# EAGLE board buf_full_bts_v21 (EAGLE 6.5.0)
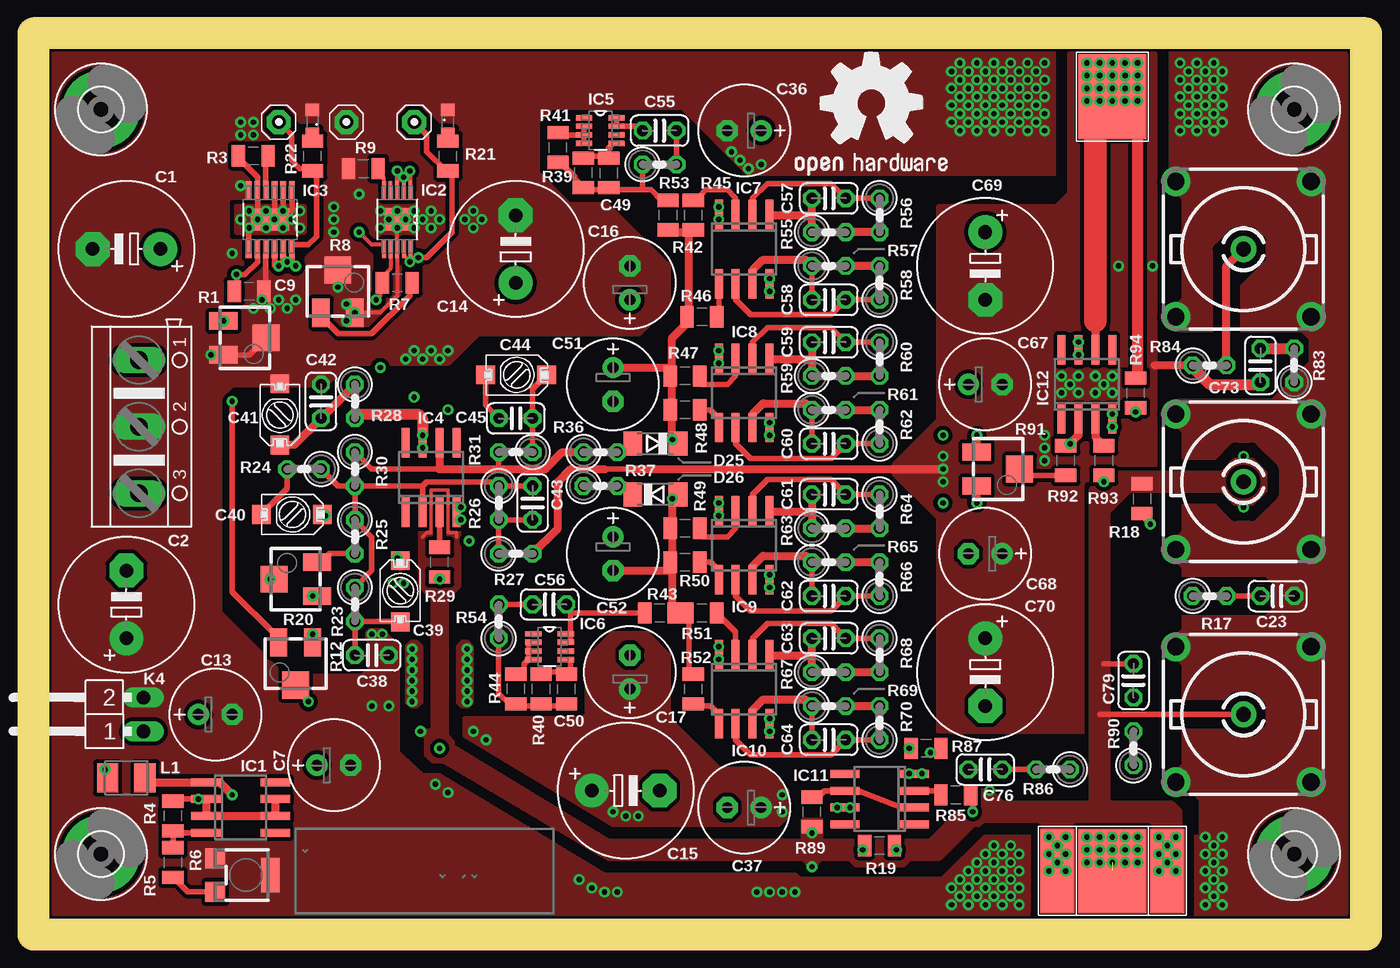
[diagram p1: board, top side]
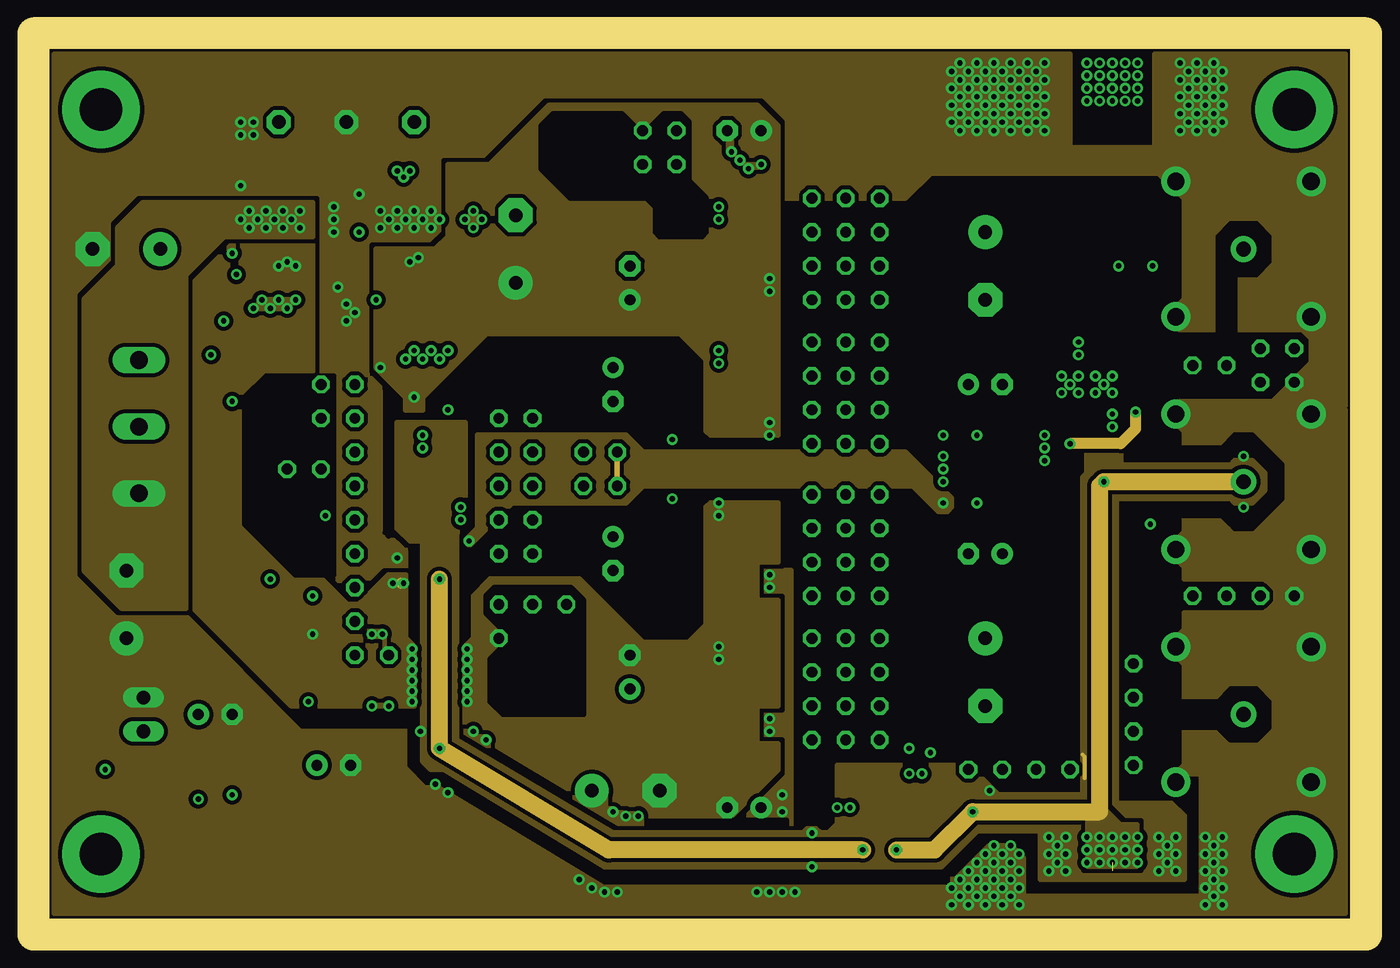
[diagram p2: board, inner layer Route2]
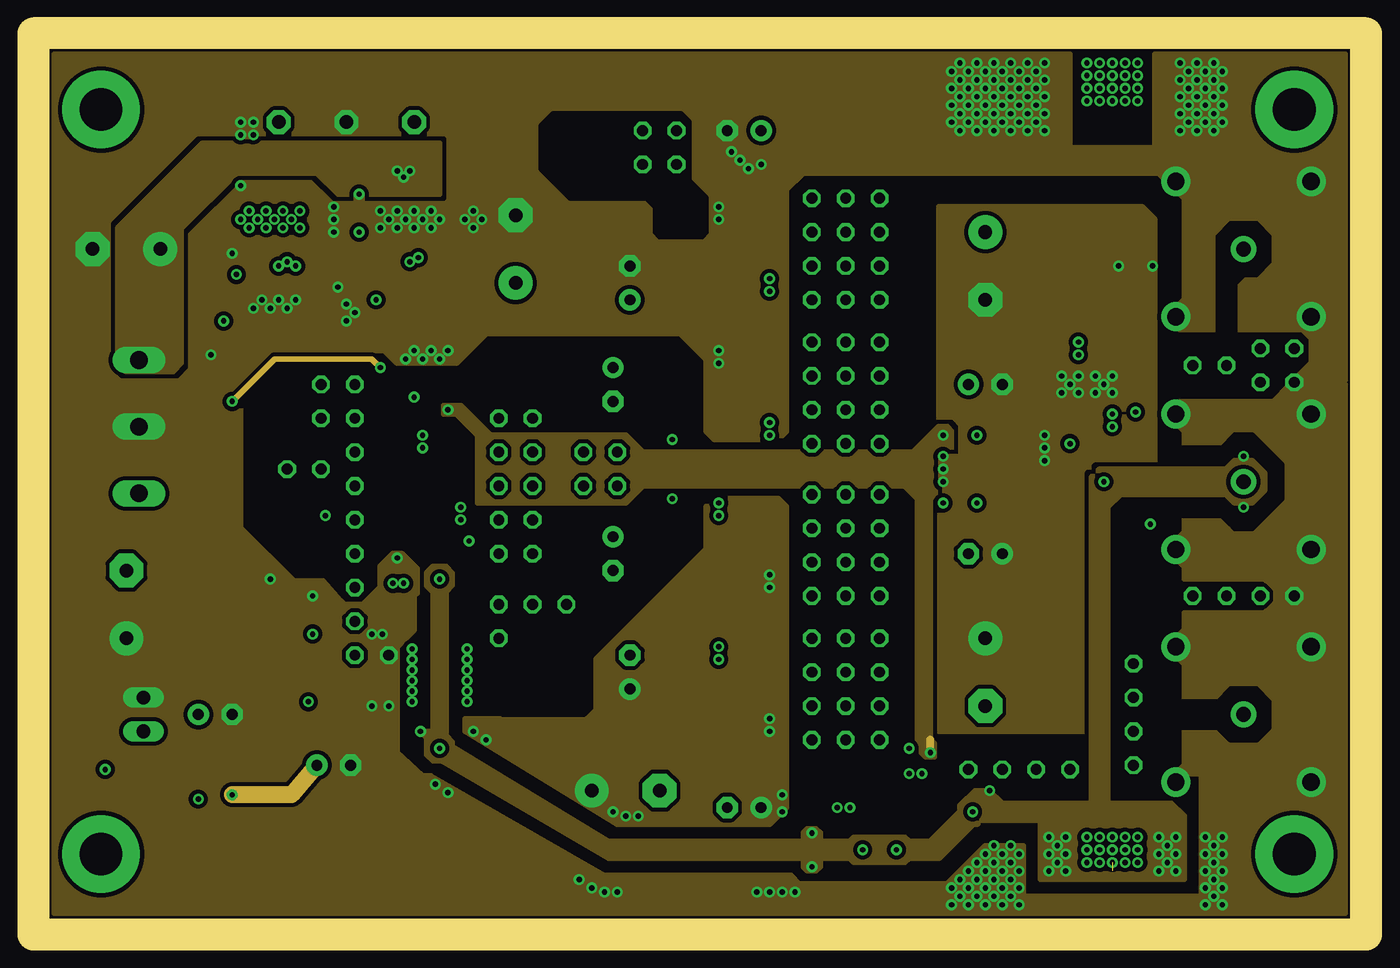
[diagram p3: board, inner layer Route15]
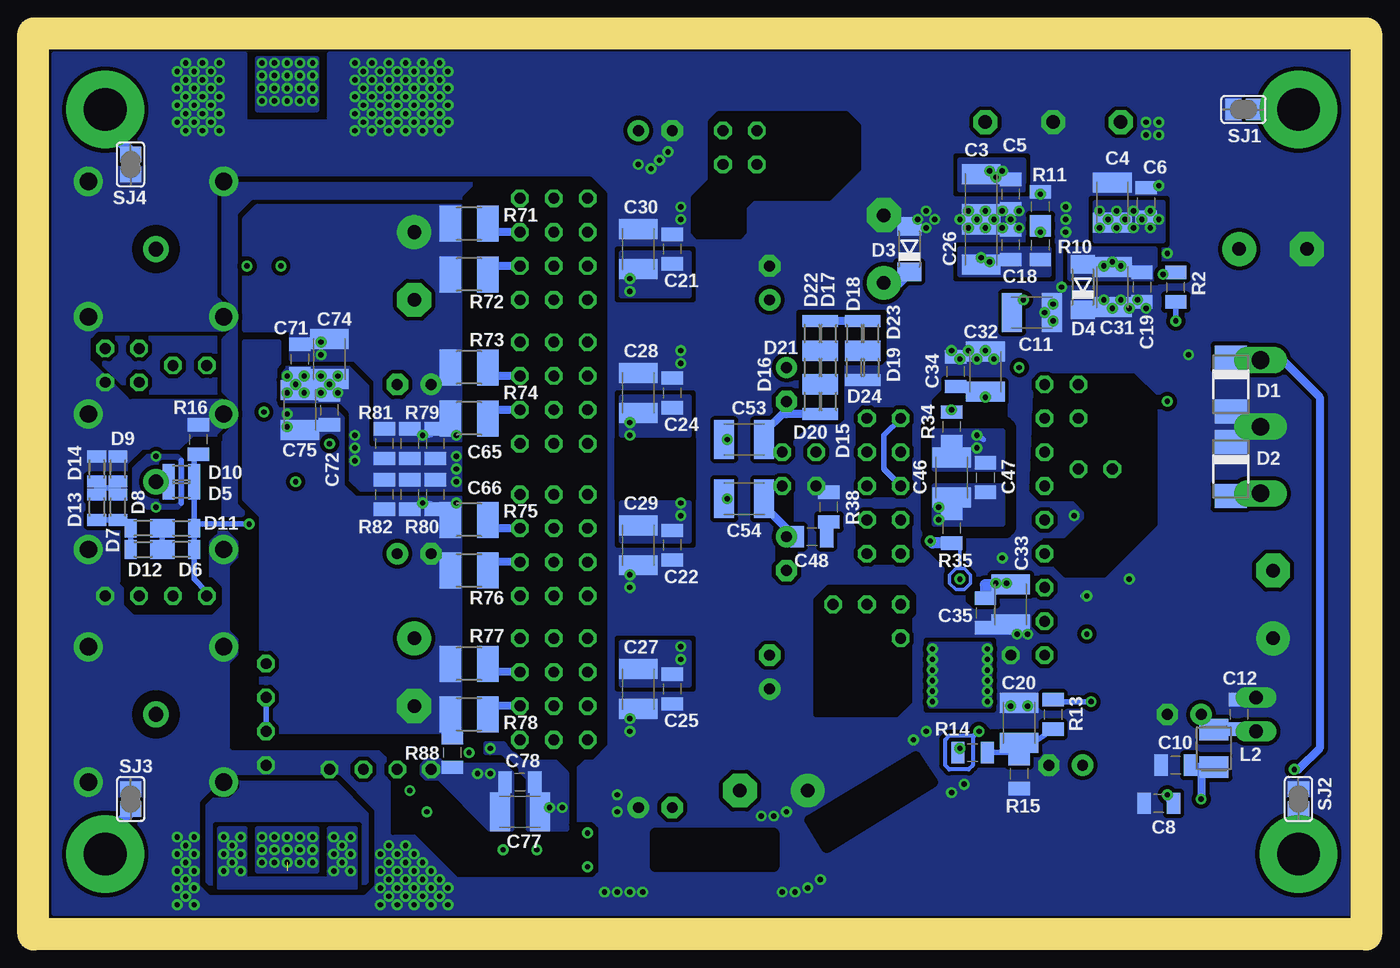
[diagram p4: board, bottom side, seen from below]

Size 100.01 x 67.63 mm. Coordinates in mm from the lower left corner, seen from the top.
Outline: 0,0 100.01,0 100.01,67.63 0,67.63 0,0
Copper layers (1*2+15*16): Top 0.035mm / dielectric 0.5mm / Route2 0.035mm / dielectric 0.35mm / Route15 0.035mm / dielectric 0.5mm / Bottom 0.035mm
Design rules "default *": minimum track width 10mil, minimum drill 24mil, track to track 8mil, track to pad 8mil, pad to pad 8mil, via to via 8mil, smd to smd 8mil, copper to edge 1mil, drill to drill 8mil, minimum pad ring 10mil, minimum via ring 8mil, stop-mask expansion 4mil, vias tented up to drill 0mil, thermal gap 10mil
Net classes: 12 buf1mfb: clearance 0.305 mm
tRestrict: 49 lines
bRestrict: area 89.2,49.8 to 92.4,53; area 89.2,14.9 to 92.4,18.1; 131 lines

## Footprints (pad centres in the part's own frame; a part is rotated, then mirrored left to right if it is on the bottom)
E5-10,5 = drill 1.016 pad 2.54: + -2.54,0 | drill 1.016 pad 2.54 octagon: - 2.54,0
C1210K = smd 1.5 x 2.9: 1 -1.5,0; 2 1.5,0
X0805 = smd 1 x 1.6: P$1 -1.111,0; P$2 1.111,0
E2,5-7 = drill 0.813 pad 1.6: + -1.27,0 | drill 0.813 pad 1.6 octagon: - 1.27,0
C025-024X044 = drill 0.813 octagon: 1 -1.27,0; 2 1.27,0
CTRIMMER9344 = smd 1.4 x 1.4: 1 1.5,-0.041; 2 1.5,4.541
DO-214AC = smd 1.8 x 2.4: A 2.025,0; C -2.025,0
SOD80C = smd 1.4 x 1.8: A 1.7,0; C -1.7,0
MICROMELF-W = smd 0.9 x 1.4: A 0.95,0; C -0.95,0
3,2-PAD = drill 3.2 pad 5.842: B3,2 0,0
SO08 = smd 0.6 x 2.2: 1 -1.905,-2.6; 2 -0.635,-2.6; 3 0.635,-2.6; 4 1.905,-2.6; 5 1.905,2.6; 6 0.635,2.6; 7 -0.635,2.6; 8 -1.905,2.6
SOP50P490X110-11N = smd 1.397 x 0.279: 1 -2.184,0.991; 2 -2.184,0.508; 3 -2.184,0; 4 -2.184,-0.508; 5 -2.184,-0.991; 6 2.184,-0.991; 7 2.184,-0.508; 8 2.184,0; 9 2.184,0.508; 10 2.184,0.991 | smd 1.676 x 1.88: 11 0,0
SOP65P490X110-13N = smd 1.397 x 0.432: 1 -2.184,1.626; 2 -2.184,0.965; 3 -2.184,0.33; 4 -2.184,-0.33; 5 -2.184,-0.965; 6 -2.184,-1.626; 7 2.184,-1.626; 8 2.184,-0.965; 9 2.184,-0.33; 10 2.184,0.33; 11 2.184,0.965; 12 2.184,1.626 | smd 1.651 x 2.845: 13 0,0
SO8 = smd 0.6 x 2.2: 1 -1.905,-2.6; 2 -0.635,-2.6; 3 0.635,-2.6; 4 1.905,-2.6; 5 1.905,2.6; 6 0.635,2.6; 7 -0.635,2.6; 8 -1.905,2.6
SOT65P280X100-8N = smd 1.219 x 0.406: 1 -1.219,0.965; 2 -1.219,0.33; 3 -1.219,-0.33; 4 -1.219,-0.965; 5 1.219,-0.965; 6 1.219,-0.33; 7 1.219,0.33; 8 1.219,0.965
SMD_1X1_S9 = smd 6.35 x 2.54: 1 0,0
SMD_1X1_S8 = smd 6.35 x 5.08: 1 0,0
MA02-1W = drill 1.016 long: 1 -1.27,-2.54; 2 1.27,-2.54
SP_PRO = drill 1.016 pad 1.778 octagon: P$1 0,0
L3225M = smd 1.6 x 2.2: 1 -1.4,0; 2 1.4,0
D0603 = smd 0.94 x 1.016: A -0.901,0; K 0.901,0
RTRIM3214W = smd 1.3 x 2.108: 1 -1.275,-1.609; 3 1.275,-1.609 | smd 2 x 2.032: 2 0,1.609
RT3364W = smd 1.5 x 1.5: 1 -1.25,-2.217; 3 1.25,-2.217 | smd 2.6 x 1.4: 2 0,1.917
0207/2V = drill 0.813 octagon: 1 -1.27,0; 2 1.27,0
R1210 = smd 1.6 x 2.7: 1 -1.4,0; 2 1.4,0
SJ = smd 1.168 x 1.6: 1 -0.762,0; 2 0.762,0
AK500/3 = drill 1.321 long: 1 -5.004,0; 2 0,0; 3 5.004,0
A1944 = drill 1.1 pad 1.93: 1 0,0 | drill 1.3 pad 2.184: 2 5.08,5.08; 3 -5.08,5.08; 4 -5.08,-5.08; 5 5.08,-5.08

## Placement (x,y rotation side)
C1  820u  [E5-10,5]  6.99,51.44 180 top
C2  820u  [E5-10,5]  6.99,24.76 90 top
C3  10u  [C1210K]  28.89,55.56 270 bottom
C4  10u  [C1210K]  19.05,54.93 270 bottom
C5  100n  [X0805]  26.67,55.56 270 bottom
C6  100n  [X0805]  16.51,54.93 270 bottom
C7  220u  [E2,5-7]  22.54,12.7 0 top
C8  100n  [X0805]  15.56,9.84 180 bottom
C9  100n  [X0805]  16.19,48.26 180 top
C10  100n  [X0805]  14.29,12.7 180 bottom
C11  22u  [C1210K]  25.08,46.67 0 bottom
C12  100n  [X0805]  9.53,16.51 90 bottom
C13  220u  [E2,5-7]  13.65,16.51 0 top
C14  820u  [E5-10,5]  36.2,51.44 90 top
C15  820u  [E5-10,5]  44.45,10.79 0 top
C16  220u  [E2,5-7]  44.77,48.89 90 top
C17  220u  [E2,5-7]  44.77,19.68 90 top
C18  100n  [X0805]  26.67,51.75 90 bottom
C19  100n  [X0805]  16.83,48.58 90 bottom
C20  10u  [C1210K]  26.04,15.87 90 bottom
C21  100n  [X0805]  52.07,51.44 90 bottom
C22  100n  [X0805]  52.07,29.21 90 bottom
C23  27p  [C025-024X044]  93.34,25.4 180 top
C24  100n  [X0805]  52.07,40.64 90 bottom
C25  100n  [X0805]  52.07,18.42 90 bottom
C26  10u  [C1210K]  28.89,51.75 90 bottom
C27  10u  [C1210K]  54.61,18.42 90 bottom
C28  10u  [C1210K]  54.61,40.64 90 bottom
C29  10u  [C1210K]  54.61,29.21 90 bottom
C30  10u  [C1210K]  54.61,51.44 90 bottom
C31  10u  [C1210K]  19.05,48.58 90 bottom
C32  10u  [C1210K]  28.57,42.23 90 bottom
C33  10u  [C1210K]  26.67,24.76 90 bottom
C34  100n  [X0805]  30.8,42.23 90 bottom
C35  100n  [X0805]  28.57,24.13 90 bottom
C36  220u  [E2,5-7]  53.34,60.33 180 top
C37  220u  [E2,5-7]  53.34,9.52 180 top
C38  [C025-024X044]  25.4,20.96 0 top
C39  [CTRIMMER9344]  26.04,23.5 0 top
C40  [CTRIMMER9344]  17.14,33.02 270 top
C41  [CTRIMMER9344]  20,41.28 180 top
C42  [C025-024X044]  21.59,40 270 top
C43  0p  [C025-024X044]  37.47,32.39 270 top
C44  [CTRIMMER9344]  33.97,43.5 270 top
C45  82p  [C025-024X044]  36.2,38.73 0 top
C46  10u  [C1210K]  31.11,34.29 270 bottom
C47  100n  [X0805]  28.57,34.29 270 bottom
C48  270p  [X0805]  41.59,29.85 180 bottom
C49  100n  [X0805]  43.18,57.15 270 top
C50  100n  [X0805]  40,18.42 270 top
C51  220u  [E2,5-7]  43.5,41.28 270 top
C52  220u  [E2,5-7]  43.5,28.57 270 top
C53  10u  [C1210K]  46.67,37.15 0 bottom
C54  10u  [C1210K]  46.67,32.7 180 bottom
C55  4n7  [C025-024X044]  46.99,60.33 0 top
C56  4n7  [C025-024X044]  38.73,24.76 180 top
C57  56p  [C025-024X044]  59.69,55.25 0 top
C58  56p  [C025-024X044]  59.69,47.62 0 top
C59  56p  [C025-024X044]  59.69,44.45 0 top
C60  56p  [C025-024X044]  59.69,36.83 0 top
C61  56p  [C025-024X044]  59.69,33.02 0 top
C62  56p  [C025-024X044]  59.69,25.4 0 top
C63  56p  [C025-024X044]  59.69,22.22 0 top
C64  56p  [C025-024X044]  59.69,14.61 0 top
C65  100n  [X0805]  69.85,36.83 270 bottom
C66  100n  [X0805]  69.85,33.02 270 bottom
C67  220u  [E2,5-7]  71.44,41.28 0 top
C68  220u  [E2,5-7]  71.44,28.57 180 top
C69  820u  [E5-10,5]  71.44,50.17 270 top
C70  820u  [E5-10,5]  71.44,19.68 270 top
C71  100n  [X0805]  80.01,43.18 270 bottom
C72  100n  [X0805]  77.79,39.37 270 bottom
C73  [C025-024X044]  92.08,42.7 270 top
C74  10u  [C1210K]  77.79,43.18 270 bottom
C75  10u  [C1210K]  80.01,39.37 270 bottom
C76  [C025-024X044]  71.44,12.38 180 top
C77  10u  [C1210K]  63.5,9.21 180 bottom
C78  100n  [X0805]  63.5,11.43 180 bottom
C79  39p  [C025-024X044]  82.55,19.05 90 top
D1  1N4007  [DO-214AC]  10.16,41.28 270 bottom
D2  1N4007  [DO-214AC]  10.16,34.92 270 bottom
D3  BAT43  [SOD80C]  34.29,51.44 90 bottom
D4  BAT43  [SOD80C]  21.27,48.58 90 bottom
D5  [MICROMELF-W]  88.9,33.34 0 bottom
D6  [MICROMELF-W]  88.9,28.89 180 bottom
D7  [MICROMELF-W]  91.76,30.48 180 bottom
D8  [MICROMELF-W]  93.66,32.07 90 bottom
D9  [MICROMELF-W]  93.66,34.92 90 bottom
D10  [MICROMELF-W]  88.9,34.61 180 bottom
D11  [MICROMELF-W]  88.9,30.48 0 bottom
D12  [MICROMELF-W]  91.76,28.89 0 bottom
D13  [MICROMELF-W]  95.25,32.07 270 bottom
D14  10x1N4148  [MICROMELF-W]  95.25,34.92 270 bottom
D15  10x1N4148  [MICROMELF-W]  40.32,40 90 bottom
D16  [MICROMELF-W]  40.32,42.55 90 bottom
D17  [MICROMELF-W]  40.32,45.09 90 bottom
D18  [MICROMELF-W]  38.42,45.09 270 bottom
D19  [MICROMELF-W]  37.15,42.55 270 bottom
D20  [MICROMELF-W]  41.59,40 270 bottom
D21  [MICROMELF-W]  41.59,42.55 270 bottom
D22  [MICROMELF-W]  41.59,45.09 270 bottom
D23  [MICROMELF-W]  37.15,45.09 90 bottom
D24  [MICROMELF-W]  38.42,42.55 90 bottom
D25  6V2  [SOD80C]  46.67,36.83 180 top
D26  6V2  [SOD80C]  46.67,33.02 0 top
GOLD_ORB_SM1  OSHWLOGO_GOLD_ORB_MED  [OSHW1]  56.52,55.25 0 top
H1  MOUNT-PAD-ROUND3.2  [3,2-PAD]  5.08,61.91 0 top
H2  MOUNT-PAD-ROUND3.2  [3,2-PAD]  5.08,6.03 0 top
H3  MOUNT-PAD-ROUND3.2  [3,2-PAD]  94.61,6.03 0 top
H4  MOUNT-PAD-ROUND3.2  [3,2-PAD]  94.61,61.91 0 top
IC1  LM317LD  [SO08]  15.56,9.52 270 top
IC2  LT3042  [SOP50P490X110-11N]  27.31,53.66 270 top
IC3  LT3090  [SOP65P490X110-13N]  17.78,53.66 270 top
IC4  THS4631  [SO8]  29.85,34.29 0 top
IC5  LT3092TS23  [SOT65P280X100-8N]  42.55,60.33 0 top
IC6  LT3092TS23  [SOT65P280X100-8N]  38.73,21.59 0 top
IC7  AD8066R  [SO8]  53.34,51.44 180 top
IC8  AD8066R  [SO8]  53.34,40.64 180 top
IC9  AD8066R  [SO8]  53.34,29.21 180 top
IC10  AD8066R  [SO8]  53.34,18.42 180 top
IC11  AD8065ARZ  [SO8]  63.5,10.16 90 top
IC12  OPA211  [SO8]  79.06,41.28 0 top
K1  [SMD_1X1_S9]  76.83,4.76 90 top
K2  [SMD_1X1_S8]  80.96,4.76 90 top
K3  [SMD_1X1_S9]  85.09,4.76 90 top
K4  FAN  [MA02-1W]  5.71,16.51 90 top
K5  [SP_PRO]  28.57,60.96 90 top
K6  [SP_PRO]  18.42,60.96 90 top
K7  [SP_PRO]  23.5,60.96 0 top
K8  OUTPUT  [SMD_1X1_S8]  80.96,62.87 90 top
L1  22u  [L3225M]  6.99,11.75 0 top
L2  22u  [L3225M]  11.43,13.97 90 bottom
LD1  LED-0603  [D0603]  31.11,60.96 90 top
LD2  LED-0603  [D0603]  20.96,60.96 270 top
R1  50k  [RTRIM3214W]  15.88,44.77 270 top
R2  220k  [X0805]  14.29,48.58 270 bottom
R3  68k  [X0805]  16.51,58.42 180 top
R4  510  [X0805]  10.48,8.89 90 top
R5  2k  [X0805]  10.48,5.4 90 top
R6  2k2  [RT3364W]  15.88,4.45 270 top
R7  110k  [X0805]  27.31,48.89 180 top
R8  20k  [RTRIM3214W]  22.86,48.26 0 top
R9  680  [X0805]  24.77,57.47 0 top
R10  330k  [X0805]  24.45,51.75 270 bottom
R11  10k  [X0805]  24.45,54.61 270 bottom
R12  20k  [RTRIM3214W]  19.68,20.32 180 top
R13  47k  [X0805]  23.5,16.51 270 bottom
R14  10M  [X0805]  29.53,13.65 180 bottom
R15  10k  [X0805]  26.04,12.06 90 bottom
R16  4k7  [X0805]  87.63,37.15 90 bottom
R17  51  [0207/2V]  88.27,25.4 0 top
R18  33  [X0805]  83.19,32.7 270 top
R19  24  [X0805]  63.5,6.67 180 top
R20  [RTRIM3214W]  19.68,26.67 90 top
R21  2k7  [X0805]  31.11,58.42 270 top
R22  2k7  [X0805]  20.96,58.42 90 top
R23  [0207/2V]  24.13,24.76 270 top
R24  [0207/2V]  20.32,34.92 180 top
R25  [0207/2V]  24.13,29.85 270 top
R26  0R0  [0207/2V]  34.92,32.39 270 top
R27  150  [0207/2V]  36.2,28.57 0 top
R28  [0207/2V]  24.13,40 270 top
R29  24  [X0805]  30.48,27.94 90 top
R30  [0207/2V]  24.13,34.92 270 top
R31  10  [0207/2V]  36.2,36.19 180 top
R34  5R6  [X0805]  31.11,38.1 90 bottom
R35  5R6  [X0805]  31.11,30.48 90 bottom
R36  33  [0207/2V]  42.55,36.19 0 top
R37  [0207/2V]  42.55,33.66 0 top
R38  22  [X0805]  40.32,32.07 270 bottom
R39  3k3  [X0805]  41.28,57.15 90 top
R40  3k3  [X0805]  38.1,18.42 90 top
R41  51  [X0805]  39.37,59.06 90 top
R42  4k7  [X0805]  47.62,53.98 90 top
R43  4k7  [X0805]  46.99,24.13 0 top
R44  51  [X0805]  36.2,18.42 90 top
R45  24  [X0805]  49.53,53.98 90 top
R46  24  [X0805]  50.16,46.36 0 top
R47  24  [X0805]  48.89,41.91 0 top
R48  24  [X0805]  48.89,39.37 0 top
R49  24  [X0805]  48.89,30.48 0 top
R50  24  [X0805]  48.89,27.94 0 top
R51  24  [X0805]  50.16,24.13 0 top
R52  24  [X0805]  49.53,18.42 270 top
R53  680  [0207/2V]  46.99,57.78 0 top
R54  680  [0207/2V]  34.92,23.5 90 top
R55  10  [0207/2V]  59.69,52.7 0 top
R56  100  [0207/2V]  63.5,53.98 270 top
R57  10  [0207/2V]  59.69,50.17 0 top
R58  100  [0207/2V]  63.5,48.89 90 top
R59  10  [0207/2V]  59.69,41.91 0 top
R60  100  [0207/2V]  63.5,43.18 270 top
R61  10  [0207/2V]  59.69,39.37 0 top
R62  100  [0207/2V]  63.5,38.1 90 top
R63  10  [0207/2V]  59.69,30.48 0 top
R64  100  [0207/2V]  63.5,31.75 270 top
R65  10  [0207/2V]  59.69,27.94 0 top
R66  100  [0207/2V]  63.5,26.67 90 top
R67  10  [0207/2V]  59.69,19.68 0 top
R68  100  [0207/2V]  63.5,20.96 270 top
R69  10  [0207/2V]  59.69,17.14 0 top
R70  100  [0207/2V]  63.5,15.87 90 top
R71  220m  [R1210]  67.31,53.34 180 bottom
R72  220m  [R1210]  67.31,49.53 180 bottom
R73  220m  [R1210]  67.31,42.55 180 bottom
R74  220m  [R1210]  67.31,38.73 180 bottom
R75  220m  [R1210]  67.31,31.11 180 bottom
R76  220m  [R1210]  67.31,27.3 180 bottom
R77  220m  [R1210]  67.31,20.32 180 bottom
R78  220m  [R1210]  67.31,16.51 180 bottom
R79  680  [X0805]  71.75,36.83 90 bottom
R80  680  [X0805]  71.75,33.02 90 bottom
R81  680  [X0805]  73.66,36.83 90 bottom
R82  680  [X0805]  73.66,33.02 90 bottom
R83  [0207/2V]  94.61,42.7 90 top
R84  10  [0207/2V]  88.27,42.7 0 top
R85  51  [X0805]  69.22,10.48 180 top
R86  [0207/2V]  76.52,12.38 180 top
R87  10  [X0805]  66.99,13.97 0 top
R88  10  [X0805]  68.58,13.65 270 bottom
R89  51  [X0805]  58.42,9.21 90 top
R90  51  [0207/2V]  82.55,13.97 90 top
R91  20k  [RTRIM3214W]  72.39,34.92 270 top
R92  220k  [X0805]  77.47,35.56 90 top
R93  51  [X0805]  80.33,35.56 90 top
R94  6R8  [X0805]  82.71,40.64 90 top
SJ1  [SJ]  9.21,61.91 0 bottom
SJ2  [SJ]  5.08,10.16 270 bottom
SJ3  [SJ]  92.71,10.16 270 bottom
SJ4  [SJ]  92.71,57.78 90 bottom
X1  [AK500/3]  7.94,38.1 270 top
X2  INPUT-MONITOR  [A1944]  90.8,33.97 0 top
X3  Bootstrap voltage  [A1944]  90.8,51.44 0 top
X4  EP monitor  [A1944]  90.8,16.51 0 top

## Tracks (layer width: path | path; a pad name or v marks a point on that pad's centre or on a via)
+15V  (via drill 0.4)
  Top 0.305: IC2.10 28.3,50.84 v28.89,50.8 | IC2.9 27.81,50.93 v28.26,50.48
  Top 0.406: C55.1 45.39,60.66 IC5.7 IC5.8 | IC8.8 v55.25,38.42 | IC7.8 v55.25,49.21 | v28.89,50.8 29.53,50.8 31.43,52.7 31.43,57.15 31.27,57.31 R21.P$2 30.96,57.31 29.53,58.74 29.53,60.01 K5.P$1 | R12.3 18.09,22.55 14.92,25.72 v14.92,40
  Route15 0.406: v14.92,40 18.1,43.18 25.4,43.18 v26.04,42.55
  Bottom 0.305: v28.26,50.48 v28.89,50.8
  Bottom 0.813: D3.C 35.13,48.89 C14.+ | v28.57,40.32 C32.1 28.57,40.96 29.85,40.96 C34.P$1
  other vias: 55.25,37.47 55.25,48.26
  pour Route2 (rank 2, no thermals): 55.88,37.47 55.88,60.64 54.29,62.23 38.73,62.23 34.29,57.78 31.11,57.78 31.11,52.39 30.16,51.44 25.72,51.44 25.72,42.55 27.94,40.32 27.94,39.37 29.21,39.37 29.21,40.32 33.97,45.09 48.58,45.09 50.48,43.18 50.48,37.78 50.8,37.47
  pour Bottom (rank 2, no thermals): 50.8,37.47 50.8,40.32 55.88,40.32 55.88,37.47
  pour Bottom (rank 2, no thermals): 50.8,47.94 50.8,51.12 55.88,51.12 55.88,47.94
  pour Bottom (no thermals): 23.81,49.53 30.48,49.53 30.48,51.44 23.81,51.44
+15V1
  Top 0.406: IC6.7 39.95,21.91 40.32,21.91 40.32,22.54 | 40.32,22.54 40.32,22.55 | 40.32,22.55 IC6.8 39.95,22.54 40.32,22.54 | 40.32,22.55 40.32,24.13 | 40.32,24.13 40.32,24.45 C56.1 | R43.P$1 40.32,24.13
+15V2  (via drill 0.4)
  Top 0.305: IC2.1 28.3,56.55 v28.26,57.31 | IC2.2 27.81,56.7 v27.78,56.83 | IC2.3 v27.31,57.31
  Top 0.61: v5.4,12.38 5.59,12.2 L1.1
  Bottom 0.305: v28.26,57.31 28.35,57.47 C3.1 | v27.78,56.83 27.94,57.15 | v27.31,57.31 26.99,57.15
  Bottom 0.61: X1.1 7.86,43.18 6.35,43.18 3.49,40.32 3.49,13.97 5.08,12.38 v5.4,12.38
  Bottom 0.813: D1.C 10.16,43.18 8.01,43.18 X1.1
  pour Bottom (no thermals): 25.72,55.88 30.48,55.88 30.48,58.1 25.72,58.1
  pour Route15 (no thermals): 11.11,42.86 11.11,53.02 15.24,57.15 21.27,57.15 22.86,55.56 30.48,55.56 30.48,59.37 12.7,59.37 6.35,53.02 6.35,42.86 6.99,42.23 10.48,42.23
-15V  (via drill 0.4)
  Top 0.406: C50.P$2 39.85,17.14 38.1,17.14 R40.P$1 37.94,17.14 36.2,17.14 R44.P$1 35.72,17.3 34.92,18.1 R54.1 | IC9.4 v51.44,31.43 | IC10.4 v51.44,20.64 | IC3.11 18.75,50.5 v19.05,50.48 | IC3.10 18.11,50.18 v18.42,50.17 | v19.68,50.17 19.41,50.2 IC3.12 19.41,51.75 20.64,51.75 21.27,52.39 21.27,56.83 20.96,57.15 R22.P$1 20.48,57.31 20.32,57.47 20,57.47 19.37,58.1 19.37,60.01 K6.P$1 | R12.1 21.3,21.91 v20.96,22.54
  Route2 0.813: v27.78,26.35 27.62,26.35
  Bottom 0.406: v19.05,50.48 18.73,50.39 C31.2
  Bottom 0.813: 28.57,25.63 28.57,26.26 C33.2 | 28.57,25.63 C33.2 | C35.P$2 28.57,25.63 | C33.2 v27.78,26.35
  other vias: 51.44,21.59 51.44,32.39 28.42,17.46 28.42,18.26 28.42,19.05 28.42,19.84 28.42,20.64 28.42,21.43 32.54,17.46 32.54,18.26 32.54,19.05 32.54,19.84 32.54,20.64 32.54,21.43 26.99,26.35
  pour Bottom (rank 2, no thermals): 50.8,18.73 55.88,18.73 55.88,21.91 50.8,21.91
  pour Bottom (rank 2, no thermals): 50.8,29.53 55.88,29.53 55.88,32.39 50.8,32.39
  pour Route2 (rank 2, no thermals): 50.8,32.39 55.88,32.39 55.88,27.94 54.29,27.94 54.29,25.08 55.88,25.08 55.88,17.14 54.29,17.14 54.29,14.29 55.88,14.29 55.88,12.38 52.39,8.89 43.5,8.89 32.39,15.56 32.39,21.59 33.02,22.22 33.02,25.4 34.29,26.67 40.96,26.67 45.72,21.91 49.21,21.91 50.48,23.18 50.48,32.07
  pour Route2 (rank 2, no thermals): 12.07,52.39 20.96,52.39 20.96,27.3 23.5,24.76 24.45,24.76 26.67,26.99 27.94,26.99 27.94,22.22 28.57,21.59 28.57,17.14 19.37,17.14 12.07,24.45
  pour Bottom (rank 2, no thermals): 28.26,17.14 28.26,21.75 32.7,21.75 32.7,17.14
  pour Bottom (no thermals): 15.88,49.21 22.22,49.21 22.22,51.44 15.88,51.44
  pour Top: 28.1,21.59 28.42,21.91 28.73,21.91 29.05,21.59 29.05,17.46 28.73,17.14 28.42,17.14 28.1,17.46
  pour Top: 31.91,21.59 32.23,21.91 32.54,21.91 32.86,21.59 32.86,17.46 32.54,17.14 32.23,17.14 31.91,17.46
-15V1  (via drill 0.4)
  Top 0.406: IC3.1 19.41,54.29 19.37,54.29 | IC3.2 v18.75,54.29 v18.73,54.29 | IC3.3 18.11,54.29 18.1,54.29 | C6.P$2 16.82,53.82 IC3.5 16.82,56.84 15.4,58.26 R3.P$2 | IC3.7 16.15,53.02 v16.19,53.02
  Bottom 0.813: X1.3 9.96,33.1 D2.A
  other vias: 16.19,54.29 16.83,53.66 17.46,54.29 17.46,53.02 18.1,53.66 18.73,53.02 19.37,53.66 20,54.29 20,53.02 15.56,53.66
  pour Bottom (no thermals): 15.24,52.07 20.32,52.07 20.32,54.93 15.24,54.93
  pour Top (no thermals): 15.24,52.7 20.32,52.7 20.32,54.61 15.24,54.61
  pour Route2 (no thermals): 3.81,27.3 6.67,24.45 11.43,24.45 11.43,49.53 14.29,52.39 20.96,52.39 20.96,54.93 8.26,54.93 6.35,53.02 6.35,50.17 3.81,47.62
BTS+  (via drill 0.4)
  Top 0.406: 70.78,36.17 R91.1
  Top 0.61: 70.78,36.17 v70.8,37.47 | R87.P$2 67.94,13.65 v67.31,13.65 | IC12.7 v78.42,44.45
  Route15 0.61: v67.31,13.65 67.31,14.61
  Bottom 0.406: R34.P$2 v31.11,39.37 | 68.9,53.34 R71.2
  Bottom 0.61: v70.8,37.47 70.17,37.62 C65.P$1
  other vias: 68.26,37.47 78.42,43.5
  pour Bottom (rank 2, no thermals): 67.94,54.61 67.94,37.15 74.3,37.15 74.3,41.59 75.88,43.18 80.64,43.18 80.64,45.4 84.14,45.4 84.14,53.66 83.19,54.61
  pour Route15 (no thermals): 65.41,33.66 66.36,32.7 66.36,13.97 66.99,13.33 67.63,13.33 67.63,14.29 67.31,14.61 67.31,32.7 68.9,34.29 68.9,37.78 68.58,38.1 67.94,38.1 66.04,36.19 45.72,36.19 44.45,37.47 34.29,37.47 32.07,39.69 30.8,39.69 30.8,39.05 31.75,39.05 33.34,37.47 33.34,32.39 44.45,32.39 45.72,33.66
BTS-  (via drill 0.4)
  Top 0.406: 70.78,33.36 R91.3
  Top 0.61: 70.78,33.36 v70.8,32.39 | IC12.4 v80.96,38.1
  Bottom 0.254: 30.48,27.46 30.8,27.46 31.27,26.99 31.27,26.35 30.8,25.88 30.16,25.88 29.69,26.35 29.69,26.99 30.16,27.46 30.48,27.46 | 30.48,27.46 30.48,28.89 30.96,29.37 R35.P$1 | R35.P$1
  Bottom 0.61: v70.8,32.39 70.17,32.23 C66.P$2
  Bottom 0.813: R35.P$1 32.54,29.37 v32.7,29.53
  other vias: 68.26,32.39 80.96,39.05
  pour Bottom (no thermals): 67.94,32.7 75.88,32.7 76.83,33.66 76.83,38.73 77.47,39.37 81.6,39.37 81.91,39.69 81.91,42.55 81.6,42.86 81.6,44.45 84.14,44.45 84.14,32.7 82.87,31.43 82.87,15.24 67.94,15.24
  pour Route2 (no thermals): 68.9,32.7 65.41,36.19 45.72,36.19 44.45,37.47 33.34,37.47 33.34,30.48 32.39,29.53 32.7,29.21 35.88,32.39 44.45,32.39 45.72,33.66 66.04,33.66 67.94,31.75 68.58,31.75 68.9,32.07
BTSG  (via drill 0.4)
  Top 0.406: 40.32,34.92 42.23,34.92 | 42.86,34.92 44.77,34.92
  Top 0.61: R27.2 39.37,30.48 39.37,33.97 40.32,34.92 | 42.23,34.92 42.86,34.92 | 44.77,34.92 v68.26,34.92 | R84.1 84.14,42.7
  Top 0.813: R84.1 87,42.55 88.27,41.28 91.92,41.28 C73.2
  other vias: 77.15,41.91 77.15,40.64 77.79,41.28 78.42,41.91 78.42,40.64 79.69,41.91 79.69,40.64 80.33,41.28 80.96,41.91 80.96,40.64 68.26,35.88 68.26,33.97 75.88,35.56 75.88,36.51 75.88,37.47 81.44,50.17 83.98,50.17
  pour Route15 (rank 2, no thermals): 67.94,15.24 82.87,15.24 82.87,31.75 84.14,33.02 84.14,53.66 83.19,54.61 67.94,54.61
  pour Top (rank 4, no thermals): 67.94,31.27 67.94,15.24 82.87,15.24 82.87,31.43 84.14,32.7 84.14,66.04 77.79,66.04 77.79,55.56 76.83,54.61 67.94,54.61 67.94,38.58 64.61,35.24 64.61,34.61
  pour Bottom (rank 4, no thermals): 67.94,33.34 75.56,33.34 76.2,33.97 76.2,39.37 76.83,40 80.96,40 81.28,40.32 81.28,42.23 80.96,42.55 76.2,42.55 74.93,41.28 74.93,36.83 74.61,36.51 67.94,36.51
EP  (via drill 0.4)
  Top 0.254: 31.75,29.85 31.75,30.16 31.11,30.16 31.11,33.34 29.85,33.34 29.85,30.16 29.53,30.16 29.21,29.85
  Top 0.406: X4.1 80.01,16.51 | C79.2 80.33,20.32
  Route2 0.305: 78.9,11.75 78.9,13.33 78.74,13.49
  Bottom 0.305: 29.53,14.92 31.27,14.92 31.59,14.61 31.59,12.7 31.27,12.38 29.85,12.38 29.53,12.7 29.53,14.92 | v29.05,15.24 29.37,14.92 29.53,14.92
  Bottom 0.406: 88.9,32.39 88.9,35.56
  other vias: 58.42,7.62 58.42,5.08 77.47,7.3 76.2,7.3 76.83,6.67 77.47,6.03 76.2,6.03 76.83,5.4 77.47,4.76 76.2,4.76 84.45,7.3 85.72,7.3 85.09,6.67 84.45,6.03 85.72,6.03 85.09,5.4 85.72,4.76 84.45,4.76 90.8,35.88 90.8,32.07 71.75,10.79
  pour Top (no thermals): 29.53,13.49 30,13.02 30.8,13.02 43.18,5.71 57.78,5.71 58.42,5.08 59.05,5.71 61.28,5.71 61.75,5.24 65.25,5.24 65.72,5.71 67.94,5.71 70.48,8.25 70.96,8.25 71.28,8.57 75.56,8.57 75.88,8.25 75.88,4.45 77.79,4.45 77.79,8.25 78.11,8.57 83.82,8.57 84.14,8.25 84.14,4.45 86.04,4.45 86.04,9.21 85.41,9.84 80.64,9.84 80.64,31.75 82.23,33.34 89.22,33.34 90.17,32.39 91.44,32.39 92.39,33.34 92.39,34.61 91.44,35.56 90.17,35.56 89.22,34.61 79.69,34.61 79.69,33.66 79.38,33.34 79.38,9.84 72.71,9.84 71.75,10.79 71.12,10.79 67.31,6.98 59.05,6.98 59.05,8.57 57.78,8.57 57.78,6.98 43.18,6.98 31.43,14.13 31.43,14.45 30.96,14.92 30.96,25.24 31.91,26.19 31.91,30.16 32.07,30.32 32.07,33.02 28.89,33.02 28.89,30.32 29.05,30.16 29.05,26.19 30,25.24 30,15.24 29.05,15.24 29.53,14.76
  pour Route15 (no thermals): 79.38,34.29 80.01,34.92 89.53,34.92 90.17,35.56 91.44,35.56 92.39,34.61 92.39,33.34 91.44,32.39 90.17,32.39 89.53,33.02 81.6,33.02 80.64,32.07 80.64,9.84 85.41,9.84 86.36,8.89 86.36,4.13 75.56,4.13 75.56,8.57 71.12,8.57 70.8,8.25 70.48,8.25 67.94,5.71 65.72,5.71 65.41,5.4 61.59,5.4 61.28,5.71 59.05,5.71 59.05,5.08 58.74,4.76 58.1,4.76 57.78,5.08 57.78,5.71 43.18,5.71 30.64,13.02 30,13.02 29.53,13.49 29.53,14.76 29.05,15.24 30,15.24 30,25.72 29.53,26.19 29.53,27.15 30,27.62 30.96,27.62 31.43,27.15 31.43,26.19 30.96,25.72 30.96,14.92 31.43,14.45 31.43,14.13 43.18,6.98 57.78,6.98 57.78,7.62 58.1,7.94 58.74,7.94 59.05,7.62 59.05,6.98 61.28,6.98 61.59,7.3 65.41,7.3 65.72,6.98 67.31,6.98 69.53,9.21 69.53,9.68 70.64,10.79 71.75,10.79 72.71,9.84 79.38,9.84
  pour Route2 (rank 2, no thermals): 59.69,7.62 59.05,7.62 58.74,7.94 58.1,7.94 57.78,7.62 43.5,7.62 31.75,14.61 31.75,29.85 32.39,30.48 32.39,38.42 27.31,38.42 27.31,30.48 28.26,29.53 29.21,29.53 29.21,13.02 29.85,12.38 30.8,12.38 42.86,5.08 68.1,5.08 70.8,7.78 75.56,7.78 75.56,4.13 86.36,4.13 86.36,8.89 85.41,9.84 81.28,9.84 81.28,32.7 89.85,32.7 90.17,32.39 91.44,32.39 92.39,33.34 92.39,34.61 91.44,35.56 90.17,35.56 89.85,35.24 81.6,35.24 81.6,39.69 79.06,39.69 79.06,34.61 78.74,34.29 78.74,10.48 72.39,10.48 70.17,12.7 60.33,12.7 60.33,8.25
  pour Bottom (no thermals): 88.58,35.24 89.22,35.88 91.44,35.88 92.39,34.92 92.39,33.02 91.44,32.07 89.22,32.07 88.58,32.7
  pour Bottom (no thermals): 75.88,3.49 80.96,3.49 80.96,4.13 77.79,4.13 77.79,7.94 75.88,7.94
  pour Bottom (no thermals): 80.96,3.49 86.04,3.49 86.04,7.94 84.14,7.94 84.14,4.13 80.96,4.13
GND  (via drill 0.4)
  Top 0.305: R8.3 24.16,46.67 26.04,46.67 27.31,47.94 IC2.8 v27.31,53.02
  Top 0.406: IC3.9 17.45,48.26 C9.P$1 | IC3.6 16.15,56.2 v15.56,56.2 | IC10.8 v55.25,16.19 | IC7.4 v51.44,53.66 | IC8.4 v51.44,42.86 | v55.25,26.99 IC9.8 | R20.1 v20.96,25.4 | R20.2 v17.78,26.67 | C40.2 21.77,31.43 v21.91,31.43 | C39.2 27.54,28.17 v27.31,28.26 | v13.34,43.5 R1.3 16.21,43.49 R1.2 | R8.2 v22.86,48.58
  Bottom 0.406: v20.96,25.4 21.27,25.4
  other vias: 26.04,54.29 26.04,53.02 26.67,53.66 27.31,54.29 27.94,53.66 28.57,54.29 28.57,53.02 29.21,53.66 29.85,54.29 29.85,53.02 55.25,15.24 55.25,26.04 51.44,43.81 51.44,54.61 19.68,47.62 19.05,46.99 18.42,47.62 17.14,47.62 17.78,46.99 16.51,46.99 23.5,47.31 23.5,46.04 24.13,46.67 30.48,53.66 27.94,43.18 29.21,43.18 28.57,43.81 30.48,43.18 29.85,43.81 31.11,43.81 24.45,55.56 14.92,51.12 25.4,22.54 22.54,52.7 22.54,53.66 22.54,54.61 16.51,60.01 15.56,60.01 16.51,60.96 15.56,60.96 32.39,53.66 33.02,54.29 33.02,53.02 33.66,53.66 43.5,9.21 42.86,3.18 41.91,3.49 40.96,4.13 43.81,3.18 45.4,8.89 44.45,8.89 54.29,3.18 55.25,3.18 56.2,3.18 57.15,3.18 56.2,9.21 56.2,10.48 53.66,57.47 54.61,57.78 53.02,58.1 52.39,58.74 26.67,17.14 25.4,17.14 26.19,22.54 75.88,65.41 75.88,64.14 75.25,64.77 75.25,63.5 75.88,62.87 74.61,64.14 74.61,65.41 73.98,64.77 73.34,65.41 72.71,64.77 73.34,64.14 73.98,63.5 74.61,62.87 73.34,62.87 72.71,63.5 72.07,64.14 72.07,65.41 72.07,62.87 71.44,63.5 71.44,64.77 70.8,65.41 70.8,64.14 70.8,62.87 70.17,64.77 70.17,63.5 69.53,65.41 69.53,64.14 69.53,62.87 68.9,63.5 68.9,64.77 86.04,62.87 86.04,64.14 86.68,63.5 86.68,64.77 86.04,65.41 87.31,64.14 87.31,62.87 87.95,63.5 87.95,64.77 87.31,65.41 88.58,65.41 88.58,64.14 88.58,62.87 89.22,63.5 89.22,64.77 86.68,62.23 87.95,62.23 86.04,61.59 87.31,61.59 88.58,61.59 89.22,62.23 89.22,60.96 87.95,60.96 86.68,60.96 86.04,60.33 87.31,60.33 88.58,60.33 73.98,2.22 73.34,2.86 73.98,3.49 73.34,4.13 73.98,4.76 73.34,5.4 73.98,6.03 73.34,6.67 72.71,6.03 72.71,4.76 72.71,3.49 72.71,2.22 72.07,2.86 72.07,4.13 72.07,5.4 72.07,6.67 71.44,6.03 71.44,4.76 71.44,3.49 71.44,2.22 70.8,2.86 70.8,4.13 70.8,5.4 70.17,4.76 70.17,3.49 70.17,2.22 69.53,2.86 69.53,4.13 68.9,3.49 68.9,2.22 87.95,2.22 88.58,2.86 89.22,2.22 87.95,3.49 89.22,3.49 88.58,4.13 87.95,4.76 89.22,4.76 88.58,5.4 87.95,6.03 89.22,6.03 88.58,6.67 87.95,7.3 89.22,7.3 33.02,15.24 33.97,14.61 31.11,10.64 30.16,11.27 75.25,62.23 75.25,60.96 74.61,61.59 73.98,62.23 72.71,62.23 73.34,61.59 73.98,60.96 74.61,60.33 73.34,60.33 72.71,60.96 72.07,61.59 72.07,60.33 71.44,60.96 71.44,62.23 70.8,61.59 70.8,60.33 70.17,62.23 70.17,60.96 69.53,61.59 69.53,60.33 68.9,60.96 68.9,62.23 75.88,61.59 75.88,60.33
  pour Bottom (rank 5, no thermals): 1.27,1.59 98.42,1.59 98.42,66.04 84.14,66.04 84.14,60.96 77.79,60.96 77.79,66.04 1.27,66.04
  pour Top (rank 5, no thermals): 1.59,35.88 13.97,35.88 13.97,40.32 14.92,41.28 21.91,41.28 23.5,42.86 31.11,42.86 33.34,45.09 45.4,45.09 47.62,47.31 47.62,50.17 43.02,54.77 40.16,54.77 37.78,57.15 37.78,60.96 38.89,62.07 48.74,62.07 53.66,57.15 85.72,57.15 85.72,55.88 86.36,55.25 86.36,47.62 85.72,46.99 85.72,45.72 86.04,45.4 95.25,45.4 95.88,44.77 95.88,42.86 93.03,40 86.04,40 85.72,39.69 85.72,38.42 86.36,37.78 86.36,30.16 85.72,29.53 85.72,28.26 86.36,27.62 86.36,22.86 85.72,22.22 85.72,20.96 86.36,20.32 86.36,12.7 85.72,12.06 87.63,10.16 87.63,7.3 71.44,7.3 68.26,4.13 57.47,4.13 57.15,4.45 42.86,4.45 30.48,11.91 29.21,11.91 27.31,13.65 27.31,21.59 26.04,22.86 25.4,22.86 25.08,22.54 25.08,22.22 25.4,21.91 25.4,20 24.77,19.37 18.73,19.37 13.97,24.13 13.97,35.56 1.59,35.56 1.59,1.59 98.42,1.59 98.42,66.04 1.59,66.04
  pour Top (no thermals): 55.88,8.25 56.52,8.89 56.52,10.79 54.93,12.38 51.44,12.38 47.62,16.19 47.62,20.96 46.04,22.54 43.5,22.54 41.59,20.64 41.59,16.51 41.28,16.19 32.39,16.19 32.39,14.92 43.5,8.25
  pour Route2 (rank 5, no thermals): 25.4,42.55 17.46,42.55 15.56,40.64 15.56,21.59 20,17.14 35.88,17.14 40.64,12.38 55.88,12.38
  pour Route15 (rank 5, no thermals): 94.61,41.59 98.42,41.59 98.42,66.04 84.14,66.04 84.14,59.06 77.79,59.06 77.79,66.04 1.59,66.04 1.59,1.59 98.42,1.59 98.42,41.28 94.3,41.28 93.03,40 86.04,40 85.72,39.69 85.72,38.42 86.36,37.78 86.36,30.16 85.72,29.53 85.72,28.26 86.36,27.62 86.36,26.67 92.39,26.67 93.03,26.04 93.03,24.76 92.39,24.13 86.36,24.13 86.36,22.86 85.72,22.22 85.72,20.96 86.36,20.32 86.36,12.7 85.72,12.06 87.63,12.06 87.63,2.86 74.3,2.86 74.3,6.67 71.44,6.67 68.58,3.81 57.47,3.81 56.83,4.45 42.86,4.45 29.85,11.91 29.21,11.91 27.31,13.65 27.31,21.59 28.57,22.86 28.57,25.4 28.89,25.72 28.89,27.3 27.62,28.57 26.99,28.57 26.04,27.62 26.04,26.04 24.77,24.76 23.34,24.76 23.02,25.08 21.75,26.51 19.53,26.51 15.56,30.48 15.56,41.59 17.78,43.81 26.35,43.81 27.31,42.86 31.75,42.86 33.97,45.09 48.58,45.09 50.48,43.18 50.48,37.78 51.12,37.15 55.88,37.15 56.52,37.78 56.52,55.88 57.78,57.15 84.45,57.15 86.36,55.25 86.36,47.62 85.72,46.99 85.72,45.72 86.04,45.4 95.25,45.4 95.88,44.77 95.88,42.86
  pour Route15 (no thermals): 56.52,9.52 56.52,32.07 55.88,32.7 51.12,32.7 50.48,32.07 50.48,28.89 42.23,20.64 42.23,16.83 41.59,16.19 32.39,16.19 32.39,15.24 43.81,8.25 55.25,8.25
  pour Route2 (rank 5, no thermals): 98.42,39.69 85.72,39.69 86.04,40 93.03,40 95.88,42.86 95.88,44.77 95.25,45.4 86.04,45.4 85.72,45.72 85.72,46.99 86.36,47.62 86.36,55.25 84.45,57.15 67.31,57.15 65.41,55.25 40,55.25 25.4,40.64 17.46,40.64 15.56,38.73 15.56,19.68 20,15.24 35.88,15.24 40.64,10.48 54.93,10.48 55.88,11.43 55.88,14.92 54.93,14.92 54.93,16.51 55.88,16.51 55.88,23.81 54.93,23.81 54.93,27.3 56.83,27.3 56.83,6.35 59.05,4.13 69.22,4.13 71.75,6.67 73.34,6.67 74.3,5.71 74.3,2.86 87.63,2.86 87.63,12.06 85.72,12.06 86.36,12.7 86.36,20.32 85.72,20.96 85.72,22.22 86.36,22.86 86.36,24.13 92.39,24.13 93.03,24.76 93.03,26.04 92.39,26.67 86.36,26.67 86.36,27.62 85.72,28.26 85.72,29.53 86.36,30.16 86.36,37.78 85.72,38.42 85.72,39.37 98.42,39.37 98.42,1.59 1.59,1.59 1.59,66.04 77.79,66.04 77.79,59.06 84.14,59.06 84.14,66.04 98.42,66.04
IN  (via drill 0.4)  (1 unrouted)
  Top 0.305: R19.P$1 v64.77,6.35
  Top 0.406: R85.P$1 70.48,10.48 v70.48,9.21
  Top 0.813: R93.P$1 v80.33,33.97
  Route2 1.27: v64.77,6.35 67.63,6.35 v70.48,9.21 80.01,9.21 80.01,33.66 v80.33,33.97 X2.1
  Bottom 0.406: D5.C 89.85,33.97 | 89.85,33.97 D10.A | X2.1 89.85,33.97
  other vias: 80.01,7.3 80.96,7.3 81.91,7.3 80.01,6.35 80.96,6.35 81.91,6.35 80.01,5.4 80.96,5.4 81.91,5.4 79.06,7.3 79.06,6.35 79.06,5.4 82.87,5.4 82.87,6.35 82.87,7.3
  pour Route2 (no thermals): 79.06,5.08 82.87,5.08 82.87,8.25 81.6,8.25 80.33,9.52 79.06,9.52
  pour Bottom (no thermals): 78.74,4.76 83.19,4.76 83.19,7.94 78.74,7.94
N$1
  Top 0.406: IC8.2 53.97,44.45 55.09,45.56 59.85,45.56 C59.2 R60.1
N$2
  Top 0.61: IC8.1 55.25,43.18 58.42,43.18 | C59.1 58.42,43.18 | 58.42,43.18 R59.1
N$3
  Top 0.406: R61.1 C60.1
  Top 0.61: IC8.7 53.97,39.05 54.77,39.85 57.94,39.85 R61.1
N$4
  Top 0.406: R62.1 C60.2 59.85,35.72 53.82,35.72 52.7,36.83 IC8.6
N$5
  cutout Bottom (no thermals): 58.1,13.33 58.74,13.33 59.69,12.38 60.64,13.33 63.18,13.33 64.77,14.92 67.63,14.92 67.63,55.25 66.2,56.67 58.26,56.67 57.15,55.56 57.15,14.29
N$6
  Top 0.61: R61.2 R62.2
  Bottom 0.61: R62.2 66.04,39.37 66.04,38.86 R74.1
N$7
  Top 0.61: R59.2 R60.2
  Bottom 0.61: R60.2 65.27,41.91 R73.1
N$8
  Top 0.406: IC7.2 53.97,55.25 55.09,56.36 59.85,56.36 C57.2 R56.1
N$9
  Top 0.61: R55.1 58.42,53.98 | 58.42,53.98 C57.1 | IC7.1 55.25,53.98 58.42,53.98
N$10
  Top 0.406: R57.1 C58.1
  Top 0.61: IC7.7 53.97,49.85 54.77,50.64 57.94,50.64 R57.1
N$11
  Top 0.406: IC7.6 52.7,47.62 53.82,46.51 59.85,46.51 C58.2 R58.1
N$12
  Top 0.61: R58.2 R57.2
  Bottom 0.61: R58.2 65.72,50.17 65.72,49.72 R72.1
N$13
  Top 0.61: R56.2 R55.2
  Bottom 0.61: R56.2 65.27,52.7 R71.1
N$14
  Top 0.406: IC7.3 52.7,55.25 52.07,55.88 50.48,55.88 49.69,55.09 R45.P$2
N$15
  Top 0.406: IC7.5 51.44,46.51 R46.P$2
N$16
  Top 0.406: R47.P$2 50.01,41.43 50.16,41.28 52.07,41.28 52.7,41.91 IC8.3
N$17
  Top 0.406: R48.P$2 50.8,39.37 51.44,38.73 IC8.5
N$18
  Top 0.406: R68.1 C63.2 59.85,23.34 55.09,23.34 53.97,22.22 IC10.2
N$19
  Top 0.61: IC10.1 55.25,20.96 58.42,20.96 | 58.42,20.96 C63.1 | R67.1 58.42,20.96
N$20
  Top 0.406: R69.1 C64.1
  Top 0.61: IC10.7 53.97,16.83 54.77,17.62 57.94,17.62 R69.1
N$21
  Top 0.406: IC10.6 52.7,14.61 53.82,13.49 59.85,13.49 C64.2 R70.1
N$22
  Top 0.61: R69.2 R70.2
  Bottom 0.61: R70.2 65.27,17.14 R78.1
N$23
  Top 0.61: R67.2 R68.2
  Bottom 0.61: R68.2 65.27,19.68 R77.1
N$24
  Top 0.406: IC9.2 53.97,33.02 55.09,34.13 59.85,34.13 C61.2 R64.1
N$25
  Top 0.61: C61.1 58.42,31.75 | 58.42,31.75 R63.1 | IC9.1 55.25,31.75 58.42,31.75
N$26
  Top 0.406: C62.1 R65.1
  Top 0.61: IC9.7 53.97,27.62 54.77,28.42 57.94,28.42 R65.1
N$27
  Top 0.406: IC9.6 52.7,25.4 53.82,24.29 59.85,24.29 C62.2 R66.1
N$28
  Top 0.61: R65.2 R66.2
  Bottom 0.61: R66.2 65.27,27.94 R76.1
N$29
  Top 0.61: R63.2 R64.2
  Bottom 0.61: R64.2 65.27,30.48 R75.1
N$30
  Top 0.406: R49.P$2 50.01,30 50.16,29.85 52.07,29.85 52.7,30.48 IC9.3
N$31
  Top 0.406: R50.P$2 50.8,27.94 51.44,27.3 IC9.5
N$32
  Top 0.406: IC10.3 52.7,22.7 R51.P$2
N$33
  Top 0.406: IC10.5 51.44,16.51 50.8,17.14 49.69,17.14 R52.P$2
N$34
  Top 0.406: R22.P$2 LD2.K
N$35  (via drill 0.4)
  Top 0.406: 49.05,45.88 R46.P$1 49.21,46.51 | 49.21,52.86 R45.P$1 49.53,52.7 | R42.P$1 47.31,52.7 | v47.94,37.15 D25.C
  Top 0.61: 49.21,46.51 49.21,52.86 | 47.31,52.7 49.53,52.7 | v47.94,37.15 47.94,39.37 | R48.P$1 47.94,39.37 | 47.94,39.37 47.94,41.91 | R47.P$1 47.94,41.91 | 47.94,41.91 47.94,42.55 | 47.94,42.55 47.94,44.77 48.89,45.72 48.89,46.2 R46.P$1 | C51.+ 47.94,42.55
  Bottom 0.406: C53.1 v47.94,37.15
N$36  (via drill 0.4)
  Top 0.406: R52.P$1 49.37,19.53 49.21,19.68 49.21,23.97 R51.P$1 | D26.A 48,32.65 48.26,32.96 v47.94,32.7 48.26,32.81
  Top 0.61: 48,32.65 47.94,32.59 47.94,30.48 | R49.P$1 47.94,30.48 | 47.94,30.48 47.94,27.94 | R50.P$1 47.94,27.94 | 47.94,27.94 47.94,27.3 | 47.94,27.3 47.94,24.13 R43.P$2 R51.P$1 | C52.- 47.94,27.3
  Bottom 0.406: C54.2 v47.94,32.7
N$37
  Top 0.61: R37.2 44.45,33.66 D26.C | R36.2 44.13,36.19 D25.A
  Route2 0.406: R37.2 R36.2
  Bottom 0.406: C53.2 45.49,36.19 R36.2 | C54.1 45.49,33.66 R37.2 | C48.P$2 C52.+
  Bottom 0.61: C54.1 45.17,32.16 43.5,30.48 C52.+ | C53.2 45.17,37.69 43.66,39.21 | 43.66,39.21 43.5,39.37 C51.- | 43.66,39.21 43.5,39.05 D20.A D15.C
N$38
  Top 0.406: R17.2 C23.2
N$39
  Top 0.406: IC6.5 40.31,20.62 40.32,20.64 40.32,19.84 C50.P$1 40,19.68 38.26,19.68 R40.P$2
N$40
  Top 0.406: IC4.3 R29.P$2
N$41
  Top 0.406: 30.48,34.92 25.4,34.92 R30.1 | R31.2 34.92,34.92
  Top 0.61: IC4.6 30.48,34.92 34.92,34.92 38.42,34.92 39.69,36.19 R36.1
N$42  (via drill 0.4)
  Top 0.406: IC4.7 v29.21,37.47
  Top 0.813: R28.2 24.45,39.05 28.89,39.05 29.21,38.73 v29.21,37.47
  Bottom 0.406: v29.21,37.47 28.73,37.15
  other vias: 29.21,36.51
  pour Bottom (no thermals): 27.31,34.92 32.39,34.92 32.39,37.78 27.31,37.78
N$43
  Top 0.406: R44.P$2 36.35,19.53 36.83,20 36.83,20.32 37.15,20.64 | 37.15,20.64 37.5,20.64 IC6.4 37.16,20.62 37.15,20.64 | 37.15,20.64 37.15,21.26 IC6.3 37.52,21.27 37.15,21.27 37.15,21.92 IC6.2
N$44  (via drill 0.4)
  Top 0.406: IC4.4 v32.07,32.07
  Bottom 0.406: v32.07,32.07 31.75,32.23 R35.P$2
  other vias: 32.07,31.11
  pour Bottom (no thermals): 27.31,33.66 32.39,33.66 32.39,30.8 27.31,30.8
N$45
  Top 0.406: R39.P$2 41.28,58.42 43.02,58.42 C49.P$1 43.18,59.06 43.48,59.36 IC5.5
N$46
  cutout Route2: 28.26,15.24 28.26,12.7 29.53,11.43 30.48,11.43 42.86,3.97 68.58,3.97 68.58,4.45 42.86,4.45 30.8,11.75 29.85,11.75 28.57,13.02 28.57,15.24
N$47
  Top 0.61: R28.1 C42.2 19.59,36.73 C41.2
N$48
  Top 0.406: IC5.2 IC5.3 | IC5.4 IC5.3 | IC5.3 39.54,60 R41.P$2
N$49
  Top 0.406: C43.2 R26.2 R27.1
N$50
  Top 0.406: 45.72,55.88 43.18,55.88 C49.P$2 43.02,55.88 41.28,55.88 R39.P$1 40.64,56.67 40.64,56.83 39.53,57.94 R41.P$1 | 45.72,55.88 46.36,55.88 47.15,55.09 R42.P$2 | R53.1 45.72,55.88
N$51
  Top 0.406: C44.1 33.93,39.73 C45.1 | C43.1 R26.1 34.61,33.97 29.53,33.97 29.21,33.66 | IC4.2 29.21,33.66 | 29.21,33.66 R30.2 | R30.2 R25.1 25.4,29.85 25.4,27.3 R23.1 | R24.1 22.86,33.66 R30.2
  Bottom 0.406: R26.1 36.2,34.92 36.2,37.47 C45.1
N$52
  Top 0.61: IC12.3 79.69,37.31 R93.P$2
N$53
  Top 0.406: R54.2 C56.2
N$54  (via drill 0.4)
  Top 0.305: IC2.7 26.8,49.98 26.19,49.37 R7.P$2 26.04,48.74 26.04,47.94 v25.72,47.62
  Bottom 0.305: v25.72,47.62 26.58,47.39 C11.1
N$55
  Top 0.406: R53.2 C55.2
N$56
  Top 0.406: R20.3 21.59,27.94 22.22,28.57 R25.2
N$58  (via drill 0.4)
  Top 0.61: R92.P$2 77.63,36.83 v77.79,36.83 78.42,37.47 IC12.2
  Top 0.813: R94.P$1 v82.71,39.21
  Route2 0.813: v82.71,39.21 82.71,37.94 81.6,36.83 v77.79,36.83
N$59
  Top 0.406: R91.2 74.47,34.45 R92.P$1
N$60
  Top 0.406: R8.1 21.59,46.36 22.86,45.09 25.4,45.09 28.26,47.94 28.26,48.74 R7.P$1
N$61
  Bottom 0.406: D12.C D7.A 93.34,31.12 D8.C D13.A
N$62
  Bottom 0.406: D11.C 90.33,30.48 | D6.A 90.33,28.89 | 90.33,28.89 D12.A | D7.C 90.33,30.48 | 90.33,30.48 90.33,28.89
N$63
  Top 0.406: R21.P$1 LD1.A
N$64  (via drill 0.4)
  Top 0.305: IC2.6 26.31,51.75 25.4,51.75 v24.45,52.7
  Bottom 0.305: v24.45,52.7 R10.P$1
  Bottom 0.406: R10.P$1 R11.P$2
N$65  (via drill 0.4)
  Top 0.406: v14.29,46.04 R1.1
  Bottom 0.406: R2.P$2 v14.29,46.04
N$66  (via drill 0.4)
  Top 0.406: IC3.8 16.82,50.47 15.88,49.53 v15.24,49.53 15.24,48.89 15.08,48.89 C9.P$2
  Bottom 0.406: R2.P$1 14.45,49.53 v15.24,49.53
N$67
  Bottom 0.406: D9.C 93.66,33.5 | D8.A 93.66,33.5 | D14.A 95.25,33.5 | D13.C 95.25,33.5 | 95.25,33.5 93.66,33.5
N$69
  Bottom 0.406: R14.P$1 26.04,13.65 | 26.04,13.65 R15.P$2 C20.1 | R13.P$2 26.04,13.65
N$70  (via drill 0.4)
  Top 0.406: R12.2 19.68,18.42 v20.64,17.46
  Bottom 0.406: v20.64,17.46 23.18,17.46 R13.P$1
N$71  (via drill 0.4)
  Top 0.406: R18.P$2 83.19,31.43 v83.82,30.8
  Bottom 0.406: v83.82,30.8 87.95,30.8 | 87.95,30.8 D5.A D10.C 87.95,35.72 R16.P$1 | 87.95,30.8 D11.A D6.C 87.95,26.67 87,25.72 R17.1
N$72
  Top 0.406: IC3.4 17.45,58.42 R3.P$1
N$73
  Top 0.61: R84.2 89.53,50.17 X3.1
N$74
  Top 0.406: R24.2 19.05,33.47 C40.1
N$75
  Top 0.406: C39.1 27.49,23.5 R23.2 C38.1
N$76
  Top 0.406: C44.2 37.47,40.95 C45.2 R31.1
N$77
  Bottom 0.406: C79.1 R90.2
N$78  (via drill 0.4)
  Top 0.406: IC11.7 v61.28,9.52 | R87.P$1 v65.72,13.97
  other vias: 60.33,9.52
  pour Bottom (rank 2, no thermals): 62.86,7.94 62.86,11.75 64.77,13.65 66.04,13.65 66.04,14.29 64.77,14.29 63.5,13.02 60.96,13.02 60.01,12.06 60.01,7.94
N$79
  Top 0.813: C73.1 R83.2
N$80
  Top 0.406: IC11.3 67.94,10.79 67.94,10.95 R85.P$2
N$81
  cutout Bottom (no thermals): 17.46,41.91 24.45,41.91 24.77,41.59 25.08,33.34 24.45,32.7 21.91,32.7 20.96,31.75 20.96,31.11 22.54,29.53 24.13,29.53 24.77,28.89 24.77,28.26 24.45,27.94 23.5,27.94 22.54,26.99 19.68,26.99 15.88,30.8 15.88,40.32
N$82
  Top 0.406: R89.P$2 59.05,10.48 59.37,10.79 IC11.6 61.91,10.79 65.09,9.52 IC11.2
N$83  (via drill 0.4)
  Top 0.406: IC11.4 v66.67,12.06
  other vias: 65.72,12.06
  pour Bottom (no thermals): 64.13,7.94 64.13,12.06 64.77,12.7 69.22,12.7 69.53,13.02 70.48,13.02 70.8,12.7 70.8,12.06 70.48,11.75 69.53,11.75 65.72,7.94
N$84
  cutout Bottom (no thermals): 35.24,16.51 41.28,16.51 41.28,25.08 40.32,26.04 34.61,26.04 33.97,25.4 33.97,24.13 34.29,23.81 34.29,17.46
N$85
  cutout Route2 (no thermals): 33.97,25.4 34.61,26.04 40.32,26.04 41.28,25.08 41.28,16.51 35.24,16.51 34.29,17.46 34.29,20.64 35.56,21.91 35.56,22.54 33.97,24.13
N$86
  cutout Route15 (no thermals): 34.29,17.46 35.24,16.51 41.28,16.51 41.28,25.08 40.32,26.04 34.61,26.04 33.97,25.4 33.97,24.13 34.29,23.81
N$87
  cutout Route2 (no thermals): 38.1,57.47 40.32,55.25 46.04,55.25 46.67,54.61 46.67,52.7 46.99,52.39 50.16,52.39 50.48,52.7 50.48,55.25 49.21,56.52 49.21,60.96 48.58,61.59 47.31,61.59 46.04,60.33 45.4,60.33 44.13,61.59 39.05,61.59 38.1,60.64
N$88
  cutout Bottom (no thermals): 38.1,60.64 39.05,61.59 48.58,61.59 49.21,60.96 49.21,56.52 50.48,55.25 50.48,52.7 50.16,52.39 46.99,52.39 46.67,52.7 46.67,54.61 46.04,55.25 40.32,55.25 38.1,57.47
N$89
  cutout Route15 (no thermals): 38.1,60.64 39.05,61.59 48.58,61.59 49.21,60.96 49.21,56.52 50.48,55.25 50.48,52.7 50.16,52.39 46.99,52.39 46.67,52.7 46.67,54.61 46.04,55.25 40.32,55.25 38.1,57.47
N$90
  cutout Route2 (no thermals): 20.96,41.91 17.46,41.91 15.88,40.32 15.88,30.8 19.68,26.99 22.54,26.99 22.54,41.91
N$91
  Top 0.406: C76.1 R86.2
N$92
  cutout Route2 (no thermals): 52.39,8.25 56.52,8.25 56.52,8.57 52.39,8.57
N$93
  Bottom 0.813: SJ1.2 H1.B3,2
N$94
  Bottom 0.813: H2.B3,2 SJ2.2
N$95
  Bottom 0.813: SJ3.2 92.71,9.21 94.61,7.3 H3.B3,2
N$96
  Bottom 0.813: SJ4.2 92.71,58.74 94.61,60.64 H4.B3,2
N$97  (via drill 0.4)
  Top 0.305: R19.P$2 v62.23,6.35 | v30.48,26.67 R29.P$1
  Route2 1.27: v62.23,6.35 43.18,6.35 v30.48,13.97 v30.48,26.67
  Bottom 0.406: R14.P$2 v30.48,13.97
N$98  (via drill 0.4)
  Top 0.406: IC1.3 IC1.2 v12.38,10.16 10.48,10.16 R4.P$2 | 12.96,8.95 13.02,8.89
  Top 0.61: IC1.7 IC1.6 13.02,8.89 | IC1.2 12.96,8.95
  Bottom 0.406: 12.99,12.57 C10.P$1
  Bottom 0.61: L2.1 12.99,12.57 | C10.P$1 12.38,12.38 v12.38,10.16
N$99
  Top 0.406: R5.P$2 R4.P$1 10.48,7.62 IC1.4
N$100
  Bottom 0.406: R38.P$2 40.32,30 C48.P$1
N$101
  Bottom 0.61: K4.1 9.53,15.24 | 9.53,15.24 11.3,15.24 L2.2 12.38,16.32 C13.+ | C12.P$1 9.53,15.24
N$102
  Top 0.406: R5.P$1 11.57,3.2 R6.3
N$103  (via drill 0.4)
  Top 0.406: L1.2 8.7,11.43 | IC1.1 13.97,11.43
  Top 0.61: 8.7,11.43 IC1.1 | 13.97,11.43 v14.92,10.48
  Route15 1.27: C7.+ 19.37,10.48 v14.92,10.48
  Bottom 0.406: v14.92,10.48 14.92,10.32
  Bottom 0.61: 14.92,10.32 C8.P$1
N$104
  Bottom 0.61: 37.94,43.66 37.78,43.5 D19.C D23.C | 37.94,43.66 D18.A | D24.A 38.1,43.5 37.94,43.66
N$105
  Bottom 0.61: D23.A D18.C D17.A D22.C
N$106
  Bottom 0.61: D17.C D16.A D21.C D22.A
N$107
  Bottom 0.61: 41.11,41.12 40.95,40.96 D15.A D16.C | 41.11,41.12 D21.A | D20.C 41.28,40.95 41.11,41.12
N$108
  cutout Route2: 86.36,35.88 89.53,35.88 90.49,36.83 91.12,36.83 93.03,34.92 93.03,33.02 91.44,31.43 91.12,31.11 90.49,31.11 89.53,32.07 86.36,32.07 86.36,31.43 89.22,31.43 89.85,30.8 90.17,30.48 91.44,30.48 93.66,32.7 93.66,35.24 91.76,37.15 91.44,37.47 90.17,37.47 89.22,36.51 86.36,36.51
  cutout Route15: 86.36,35.88 89.53,35.88 90.49,36.83 91.12,36.83 93.03,34.92 93.03,33.02 91.44,31.43 91.12,31.11 90.49,31.11 89.53,32.07 86.36,32.07 86.36,31.43 89.22,31.43 89.85,30.8 90.17,30.48 91.44,30.48 93.66,32.7 93.66,35.24 91.76,37.15 91.44,37.47 90.17,37.47 89.22,36.51 86.36,36.51
N$109
  cutout Route15: 89.85,14.61 91.76,14.61 92.71,15.56 92.71,17.46 91.76,18.42 89.85,18.42 88.9,17.46 86.36,17.46 86.36,15.56 88.9,15.56
  cutout Route2: 90.17,49.53 91.76,49.53 92.71,50.48 92.71,52.39 91.76,53.34 89.85,53.34 88.9,52.39 88.9,45.09 90.17,45.09
  cutout Route2: 89.85,14.61 91.76,14.61 92.71,15.56 92.71,17.46 91.76,18.42 89.85,18.42 88.9,17.46 86.36,17.46 86.36,15.56 88.9,15.56
  cutout Route15: 90.17,48.58 90.17,48.89 90.8,49.53 91.76,49.53 92.71,50.48 92.71,52.39 91.76,53.34 89.85,53.34 88.9,52.39 88.9,45.09 90.17,45.09
N$110
  cutout Route2 (no thermals): 28.57,27.3 28.57,28.89 28.26,28.89 28.26,27.3
N$111
  cutout Route2 (no thermals): 26.67,29.85 26.67,40.64 26.35,40.96 26.35,30.16
N$124
  Top 0.305: IC2.5 26.31,56.71 R9.P$2
OUT  (via drill 0.4)
  Top 0.61: R94.P$2 83.03,41.75 82.87,41.91 | 82.87,60.33 80.33,62.87 | 79.69,46.04 IC12.6
  Top 0.813: 82.87,41.91 82.87,60.33
  Top 1.27: 79.69,62.23 v80.01,62.55 80.33,62.87 K8.1
  Top 1.676: 79.69,46.04 79.69,62.23
  other vias: 79.06,65.41 80.01,65.41 80.96,65.41 81.91,65.41 82.87,65.41 82.87,64.45 81.91,64.45 80.96,64.45 80.01,64.45 79.06,64.45 79.06,63.5 80.01,63.5 80.96,63.5 81.91,63.5 82.87,63.5 82.87,62.55 81.91,62.55 80.96,62.55 79.06,62.55
  pour Bottom (no thermals): 78.74,61.91 83.19,61.91 83.19,65.72 78.74,65.72

## Text on the board
tDocu: CERN OHL license V1.2 | -12V | GND | +12V | OUTPUT | BTSG | U+REG | U-REG | U+ | GND | OFS | U- | MONITOR | BIAS | GUARD | FAN | INPUT | QuADC bootstrap buffer / CMI, V2.1, 2017-11-18 | UFAN | Stanislav Maslan / smaslan@cmi.cz